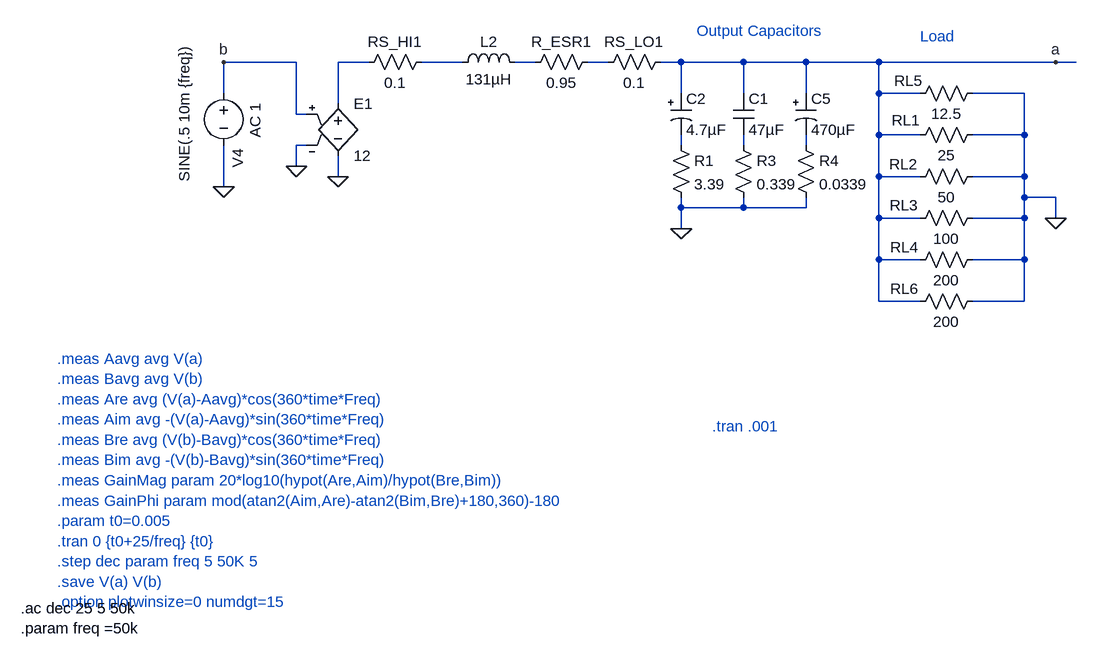
[diagram p0: schematic CL_Buck_voltage_mode_powers_stage_lin.asc]
CL_Buck_voltage_mode_powers_stage_lin.asc, the LTspice schematic file:
Version 4
SHEET 1 1732 1320
WIRE 528 288 416 288
WIRE 640 288 592 288
WIRE 784 288 720 288
WIRE 896 288 864 288
WIRE 1008 288 976 288
WIRE 1120 288 1088 288
WIRE 1216 288 1120 288
WIRE 1312 288 1216 288
WIRE 1424 288 1312 288
WIRE 1696 288 1424 288
WIRE 1728 288 1696 288
WIRE 416 336 416 288
WIRE 1120 336 1120 288
WIRE 1216 336 1216 288
WIRE 1312 336 1312 288
WIRE 1424 336 1424 288
WIRE 1488 336 1424 336
WIRE 1648 336 1568 336
WIRE 592 352 592 288
WIRE 528 368 528 288
WIRE 544 368 528 368
WIRE 1424 400 1424 336
WIRE 1488 400 1424 400
WIRE 1648 400 1648 336
WIRE 1648 400 1568 400
WIRE 544 416 528 416
WIRE 1120 416 1120 400
WIRE 1216 416 1216 400
WIRE 1312 416 1312 400
WIRE 528 448 528 416
WIRE 592 464 592 432
WIRE 1424 464 1424 400
WIRE 1488 464 1424 464
WIRE 1648 464 1648 400
WIRE 1648 464 1568 464
WIRE 416 480 416 416
WIRE 1648 496 1648 464
WIRE 1696 496 1648 496
WIRE 1120 512 1120 496
WIRE 1216 512 1216 496
WIRE 1216 512 1120 512
WIRE 1312 512 1312 496
WIRE 1312 512 1216 512
WIRE 1424 528 1424 464
WIRE 1488 528 1424 528
WIRE 1648 528 1648 496
WIRE 1648 528 1568 528
WIRE 1696 528 1696 496
WIRE 1120 544 1120 512
WIRE 1424 592 1424 528
WIRE 1488 592 1424 592
WIRE 1648 592 1648 528
WIRE 1648 592 1568 592
WIRE 1424 656 1424 592
WIRE 1488 656 1424 656
WIRE 1648 656 1648 592
WIRE 1648 656 1568 656
FLAG 528 448 0
FLAG 592 464 0
FLAG 416 288 b
FLAG 416 480 0
FLAG 1696 288 a
FLAG 1120 544 0
FLAG 1696 528 0
SYMBOL voltage 416 320 R0
WINDOW 0 22 101 VRight 2
WINDOW 3 -60 -59 VRight 2
WINDOW 123 49 31 VRight 2
WINDOW 39 0 0 Left 0
SYMATTR InstName V4
SYMATTR Value SINE(.5 10m {freq})
SYMATTR Value2 AC 1
SYMBOL e 592 336 R0
SYMATTR InstName E1
SYMATTR Value 12
SYMBOL res 1472 416 R270
WINDOW 0 23 -6 VTop 2
WINDOW 3 0 56 VBottom 2
SYMATTR InstName RL1
SYMATTR Value 25
SYMBOL ind 768 304 R270
WINDOW 0 32 56 VTop 2
WINDOW 3 5 56 VBottom 2
SYMATTR InstName L2
SYMATTR Value 131µH
SYMATTR SpiceLine Cpar=500pF
SYMBOL cap 1200 336 R0
SYMATTR InstName C1
SYMATTR Value 47µF
SYMBOL polcap 1104 336 R0
SYMATTR InstName C2
SYMATTR Value 4.7µF
SYMBOL res 992 272 R90
WINDOW 0 0 56 VBottom 2
WINDOW 3 32 56 VTop 2
SYMATTR InstName R_ESR1
SYMATTR Value 0.95
SYMBOL res 1472 480 R270
WINDOW 0 19 -10 VTop 2
WINDOW 3 0 56 VBottom 2
SYMATTR InstName RL2
SYMATTR Value 50
SYMBOL res 1104 272 R90
WINDOW 0 0 56 VBottom 2
WINDOW 3 32 56 VTop 2
SYMATTR InstName RS_LO1
SYMATTR Value 0.1
SYMBOL polcap 1296 336 R0
SYMATTR InstName C5
SYMATTR Value 470µF
SYMBOL res 1104 400 R0
SYMATTR InstName R1
SYMATTR Value 3.39
SYMBOL res 1200 400 R0
SYMATTR InstName R3
SYMATTR Value 0.339
SYMBOL res 1296 400 R0
SYMATTR InstName R4
SYMATTR Value 0.0339
SYMBOL res 1472 544 R270
WINDOW 0 20 -9 VTop 2
WINDOW 3 0 56 VBottom 2
SYMATTR InstName RL3
SYMATTR Value 100
SYMBOL res 1472 608 R270
WINDOW 0 20 -8 VTop 2
WINDOW 3 0 56 VBottom 2
SYMATTR InstName RL4
SYMATTR Value 200
SYMBOL res 1472 352 R270
WINDOW 0 20 -2 VTop 2
WINDOW 3 0 56 VBottom 2
SYMATTR InstName RL5
SYMATTR Value 12.5
SYMBOL res 1472 672 R270
WINDOW 0 20 -8 VTop 2
WINDOW 3 0 56 VBottom 2
SYMATTR InstName RL6
SYMATTR Value 200
SYMBOL res 736 272 R90
WINDOW 0 0 56 VBottom 2
WINDOW 3 32 56 VTop 2
SYMATTR InstName RS_HI1
SYMATTR Value 0.1
TEXT 160 744 Left 2 ;.meas Aavg avg V(a)\n.meas Bavg avg V(b)\n.meas Are avg (V(a)-Aavg)*cos(360*time*Freq)\n.meas Aim avg -(V(a)-Aavg)*sin(360*time*Freq)\n.meas Bre avg (V(b)-Bavg)*cos(360*time*Freq)\n.meas Bim avg -(V(b)-Bavg)*sin(360*time*Freq)\n.meas GainMag param 20*log10(hypot(Are,Aim)/hypot(Bre,Bim))\n.meas GainPhi param mod(atan2(Aim,Are)-atan2(Bim,Bre)+180,360)-180\n.param t0=0.005\n.tran 0 {t0+25/freq} {t0}\n.step dec param freq 5 50K 5\n.save V(a) V(b)\n.option plotwinsize=0 numdgt=15
TEXT 104 1128 Left 2 !.ac dec 25 5 50k\n.param freq =50k
TEXT 1168 848 Left 2 ;.tran .001
TEXT 1144 240 Left 2 ;Output Capacitors
TEXT 1488 248 Left 2 ;Load

The netlist it stands for:
* CL_Buck_voltage_mode_powers_stage_lin.asc
V4 b 0 SINE(.5 10m {freq}) AC 1
E1 N001 0 b 0 12
RL1 a 0 25
L2 N002 N003 131µH Cpar=500pF
C1 a N006 47µF
C2 a N005 4.7µF
R_ESR1 N004 N003 0.95
RL2 a 0 50
RS_LO1 a N004 0.1
C5 a N007 470µF
R1 N005 0 3.39
R3 N006 0 0.339
R4 N007 0 0.0339
RL3 a 0 100
RL4 a 0 200
RL5 a 0 12.5
RL6 a 0 200
RS_HI1 N002 N001 0.1
* .meas Aavg avg V(a)
* .meas Bavg avg V(b)
* .meas Are avg (V(a)-Aavg)*cos(360*time*Freq)
* .meas Aim avg -(V(a)-Aavg)*sin(360*time*Freq)
* .meas Bre avg (V(b)-Bavg)*cos(360*time*Freq)
* .meas Bim avg -(V(b)-Bavg)*sin(360*time*Freq)
* .meas GainMag param 20*log10(hypot(Are,Aim)/hypot(Bre,Bim))
* .meas GainPhi param mod(atan2(Aim,Are)-atan2(Bim,Bre)+180,360)-180
* .param t0=0.005
* .tran 0 {t0+25/freq} {t0}
* .step dec param freq 5 50K 5
* .save V(a) V(b)
* .option plotwinsize=0 numdgt=15
.ac dec 25 5 50k
.param freq =50k
* .tran .001
* Output Capacitors
* Load
.backanno
.end